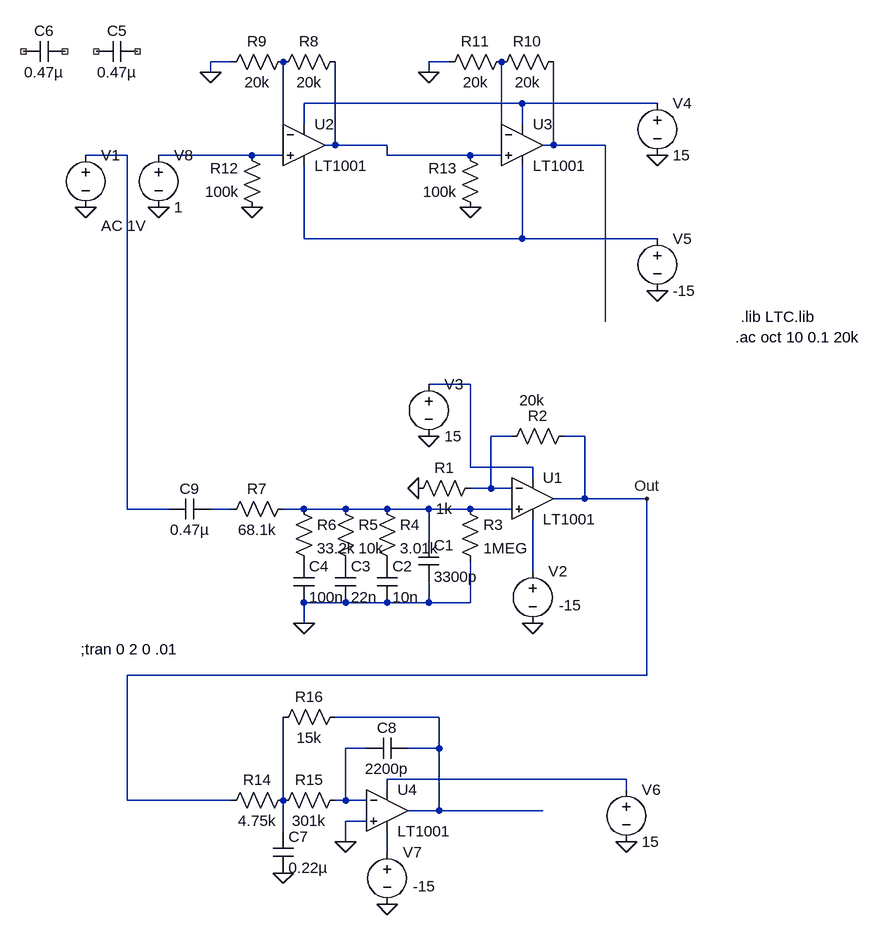
[diagram p0: schematic A6 noise gain.asc]
A6 noise gain.asc, the LTspice schematic file:
Version 4
SHEET 1 880 756
WIRE -256 -560 -288 -560
WIRE 80 -560 48 -560
WIRE -288 -544 -288 -560
WIRE 48 -544 48 -560
WIRE 192 -496 -144 -496
WIRE 400 -496 192 -496
WIRE -144 -464 -144 -496
WIRE 192 -464 192 -496
WIRE -176 -448 -176 -560
WIRE 160 -448 160 -560
WIRE -96 -432 -96 -560
WIRE -96 -432 -112 -432
WIRE -16 -432 -96 -432
WIRE 240 -432 240 -560
WIRE 240 -432 224 -432
WIRE 320 -432 240 -432
WIRE -416 -416 -480 -416
WIRE -224 -416 -368 -416
WIRE -176 -416 -224 -416
WIRE -16 -416 -16 -432
WIRE 112 -416 -16 -416
WIRE 160 -416 112 -416
WIRE -144 -288 -144 -400
WIRE 192 -288 192 -400
WIRE 192 -288 -144 -288
WIRE 400 -288 192 -288
WIRE 320 -160 320 -432
WIRE 112 -64 48 -64
WIRE 176 16 144 16
WIRE 288 16 256 16
WIRE 112 64 112 -64
WIRE 208 64 112 64
WIRE 208 80 208 64
WIRE 144 96 144 16
WIRE 144 96 112 96
WIRE 176 96 144 96
WIRE 288 112 288 16
WIRE 288 112 240 112
WIRE 384 112 288 112
WIRE -416 128 -416 -416
WIRE -352 128 -416 128
WIRE -256 128 -288 128
WIRE -144 128 -176 128
WIRE -80 128 -144 128
WIRE -16 128 -80 128
WIRE 48 128 -16 128
WIRE 112 128 48 128
WIRE 176 128 112 128
WIRE 48 176 48 128
WIRE 208 224 208 144
WIRE -80 272 -144 272
WIRE -16 272 -80 272
WIRE 48 272 48 240
WIRE 48 272 -16 272
WIRE 112 272 112 208
WIRE 112 272 48 272
WIRE -144 304 -144 272
WIRE 384 384 384 112
WIRE 384 384 -416 384
WIRE 64 448 -96 448
WIRE -48 496 -80 496
WIRE 64 496 64 448
WIRE 64 496 16 496
WIRE 352 544 -16 544
WIRE -16 560 -16 544
WIRE 352 560 352 544
WIRE -416 576 -416 384
WIRE -256 576 -416 576
WIRE -176 576 -176 448
WIRE -80 576 -80 496
WIRE -80 576 -96 576
WIRE -48 576 -80 576
WIRE 64 592 64 496
WIRE 64 592 16 592
WIRE 224 592 64 592
WIRE -48 608 -80 608
WIRE -176 624 -176 576
WIRE -80 640 -80 608
WIRE -16 656 -16 624
FLAG 384 112 Out
FLAG 48 16 0
FLAG -480 -336 0
FLAG 208 304 0
FLAG 32 96 0
FLAG -144 304 0
FLAG -288 -544 0
FLAG -224 -336 0
FLAG 112 -336 0
FLAG 48 -544 0
FLAG 400 -416 0
FLAG 400 -208 0
FLAG -80 640 0
FLAG -176 688 0
FLAG 352 640 0
FLAG -16 736 0
FLAG -368 -336 0
SYMBOL res 128 80 R90
WINDOW 0 0 56 VBottom 2
WINDOW 3 32 56 VTop 2
SYMATTR InstName R1
SYMATTR Value 1k
SYMATTR SpiceLine tol=1 pwr=0.25
SYMBOL res 272 0 R90
WINDOW 0 0 56 VBottom 2
WINDOW 3 -55 65 VTop 2
SYMATTR InstName R2
SYMATTR Value 20k
SYMATTR SpiceLine tol=1 pwr=0.25
SYMBOL voltage -480 -432 R0
WINDOW 123 24 124 Left 2
WINDOW 39 0 0 Left 2
SYMATTR Value2 AC 1V
SYMATTR InstName V1
SYMATTR Value ""
SYMBOL voltage 208 208 R0
WINDOW 3 40 68 Left 2
WINDOW 123 0 0 Left 2
WINDOW 39 0 0 Left 2
SYMATTR Value -15
SYMATTR InstName V2
SYMBOL voltage 48 -80 R0
WINDOW 123 0 0 Left 2
WINDOW 39 0 0 Left 2
SYMATTR InstName V3
SYMATTR Value 15
SYMBOL Opamps\\LT1001 208 48 R0
SYMATTR InstName U1
SYMBOL res 96 112 R0
SYMATTR InstName R3
SYMATTR Value 1MEG
SYMBOL res -32 112 R0
SYMATTR InstName R4
SYMATTR Value 3.01k
SYMBOL res -96 112 R0
SYMATTR InstName R5
SYMATTR Value 10k
SYMBOL res -160 112 R0
SYMATTR InstName R6
SYMATTR Value 33.2k
SYMBOL res -160 112 R90
WINDOW 0 0 56 VBottom 2
WINDOW 3 32 56 VTop 2
SYMATTR InstName R7
SYMATTR Value 68.1k
SYMBOL cap 32 176 R0
SYMATTR InstName C1
SYMATTR Value 3300p
SYMBOL cap -32 208 R0
SYMATTR InstName C2
SYMATTR Value 10n
SYMBOL cap -96 208 R0
SYMATTR InstName C3
SYMATTR Value 22n
SYMBOL cap -160 208 R0
SYMATTR InstName C4
SYMATTR Value 100n
SYMBOL Opamps\\LT1001 -144 -496 R0
SYMATTR InstName U2
SYMBOL Opamps\\LT1001 192 -496 R0
SYMATTR InstName U3
SYMBOL res -80 -576 R90
WINDOW 0 0 56 VBottom 2
WINDOW 3 32 56 VTop 2
SYMATTR InstName R8
SYMATTR Value 20k
SYMBOL res -160 -576 R90
WINDOW 0 0 56 VBottom 2
WINDOW 3 32 56 VTop 2
SYMATTR InstName R9
SYMATTR Value 20k
SYMBOL res 256 -576 R90
WINDOW 0 0 56 VBottom 2
WINDOW 3 32 56 VTop 2
SYMATTR InstName R10
SYMATTR Value 20k
SYMBOL res 176 -576 R90
WINDOW 0 0 56 VBottom 2
WINDOW 3 32 56 VTop 2
SYMATTR InstName R11
SYMATTR Value 20k
SYMBOL res -208 -320 R180
WINDOW 0 36 76 Left 2
WINDOW 3 36 40 Left 2
SYMATTR InstName R12
SYMATTR Value 100k
SYMBOL res 128 -320 R180
WINDOW 0 36 76 Left 2
WINDOW 3 36 40 Left 2
SYMATTR InstName R13
SYMATTR Value 100k
SYMBOL cap -400 -592 R90
WINDOW 0 0 32 VBottom 2
WINDOW 3 32 32 VTop 2
SYMATTR InstName C5
SYMATTR Value 0.47µ
SYMBOL cap -512 -592 R90
WINDOW 0 0 32 VBottom 2
WINDOW 3 32 32 VTop 2
SYMATTR InstName C6
SYMATTR Value 0.47µ
SYMBOL voltage 400 -512 R0
WINDOW 123 0 0 Left 2
WINDOW 39 0 0 Left 2
SYMATTR InstName V4
SYMATTR Value 15
SYMBOL voltage 400 -304 R0
WINDOW 123 0 0 Left 2
WINDOW 39 0 0 Left 2
SYMATTR InstName V5
SYMATTR Value -15
SYMBOL res -160 560 R90
WINDOW 0 0 56 VBottom 2
WINDOW 3 32 56 VTop 2
SYMATTR InstName R14
SYMATTR Value 4.75k
SYMBOL res -80 560 R90
WINDOW 0 0 56 VBottom 2
WINDOW 3 32 56 VTop 2
SYMATTR InstName R15
SYMATTR Value 301k
SYMBOL res -80 432 R90
WINDOW 0 0 56 VBottom 2
WINDOW 3 32 56 VTop 2
SYMATTR InstName R16
SYMATTR Value 15k
SYMBOL cap -192 624 R0
SYMATTR InstName C7
SYMATTR Value 0.22µ
SYMBOL cap 16 480 R90
WINDOW 0 0 32 VBottom 2
WINDOW 3 32 32 VTop 2
SYMATTR InstName C8
SYMATTR Value 2200p
SYMBOL Opamps\\LT1001 -16 528 R0
SYMATTR InstName U4
SYMBOL voltage 352 544 R0
WINDOW 123 0 0 Left 2
WINDOW 39 0 0 Left 2
SYMATTR InstName V6
SYMATTR Value 15
SYMBOL voltage -16 640 R0
WINDOW 3 40 68 Left 2
WINDOW 123 0 0 Left 2
WINDOW 39 0 0 Left 2
SYMATTR Value -15
SYMATTR InstName V7
SYMBOL cap -288 112 R90
WINDOW 0 0 32 VBottom 2
WINDOW 3 32 32 VTop 2
SYMATTR InstName C9
SYMATTR Value 0.47µ
SYMBOL voltage -368 -432 R0
WINDOW 123 0 0 Left 2
WINDOW 39 0 0 Left 2
SYMATTR InstName V8
SYMATTR Value 1
TEXT 528 -168 Left 2 !.lib LTC.lib
TEXT -488 344 Left 2 !;tran 0 2 0 .01
TEXT 520 -136 Left 2 !.ac oct 10 0.1 20k

The netlist it stands for:
* A6 noise gain.asc
R1 N010 0 1k tol=1 pwr=0.25
R2 Out N010 20k tol=1 pwr=0.25
V1 N006 0 AC 1V
V2 N013 0 -15
V3 N009 0 15
XU1 N012 N010 N009 N013 Out LT1001  ; pins In+ In- V+ V- OUT
R3 N012 0 1MEG
R4 N012 P001 3.01k
R5 N012 P002 10k
R6 N012 P003 33.2k
R7 N012 N011 68.1k
C1 N012 0 3300p
C2 P001 0 10n
C3 P002 0 22n
C4 P003 0 100n
XU2 N007 N002 N001 N008 N004 LT1001  ; pins In+ In- V+ V- OUT
XU3 N004 N003 N001 N008 N005 LT1001  ; pins In+ In- V+ V- OUT
R8 N004 N002 20k
R9 N002 0 20k
R10 N005 N003 20k
R11 N003 0 20k
R12 0 N007 100k
R13 0 N004 100k
C5 NC_01 NC_02 0.47µ
C6 NC_03 NC_04 0.47µ
V4 N001 0 15
V5 N008 0 -15
R14 N017 Out 4.75k
R15 N015 N017 301k
R16 N014 N017 15k
C7 N017 0 0.22µ
C8 N014 N015 2200p
XU4 0 N015 N016 N018 N014 LT1001  ; pins In+ In- V+ V- OUT
V6 N016 0 15
V7 N018 0 -15
C9 N011 N006 0.47µ
V8 N007 0 1
.lib LTC.lib
;tran 0 2 0 .01
.ac oct 10 0.1 20k
.lib LTC.lib
.backanno
.end